# Altium project PCB_3U_Kasli.PrjPCB (part 2 of 7)

## Sheet ClockRecovery.SchDoc: =ProjectName
size 420 x 297 mm; Author: G.K. and P.K.; CompanyName: WUT; DrawnBy: P.K.; Organization: WUT ISE; Address1: Warsaw Univeristy of Technology; Address2: Nowowiejska 15/19; DocumentNumber: 6; Revision: 1.1; SheetNumber: 6; SheetTotal: 12; EDA_Number: ARTIQ; Projet: ARTIQ/SINARA; ModifiedBy: -; CreateDate: XX/XX/XXXX; CheckedDate: -; Title2: ClockRecovery.SchDoc; DivGrp: ISE; Designer: G.K.; ModifiedDate: -; ProjectName: ARTIQ/SINARA
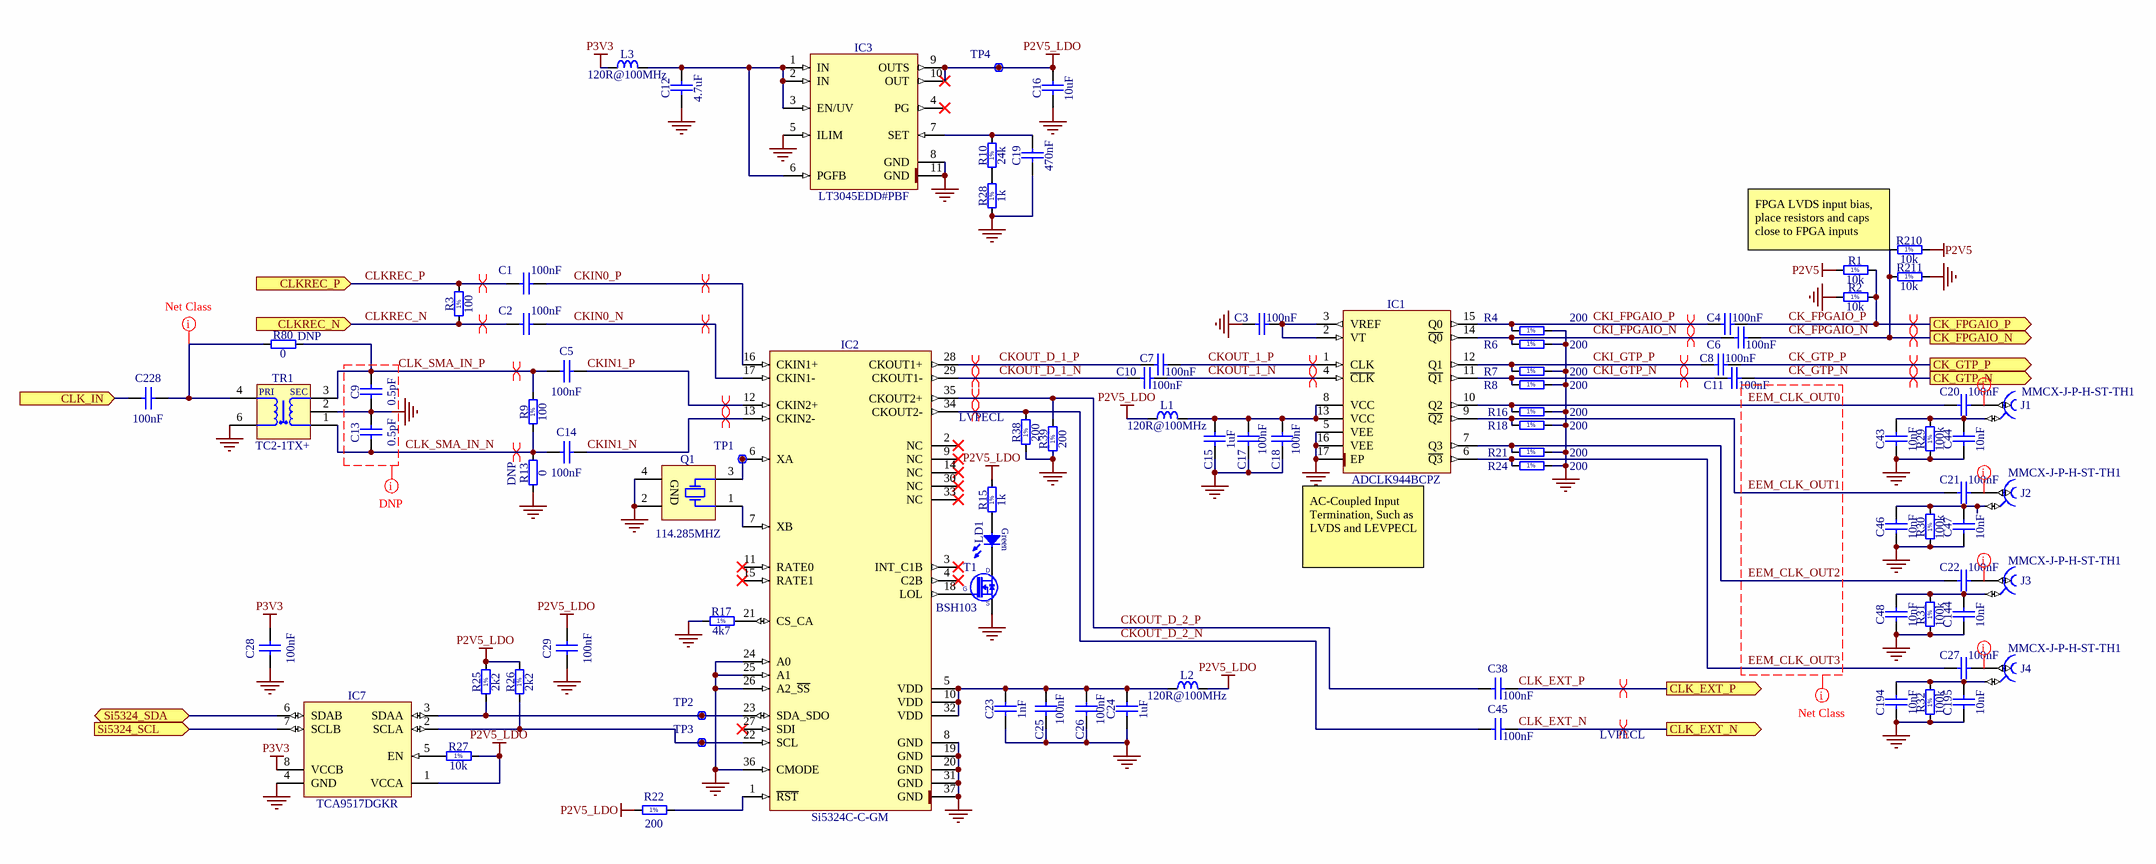
[diagram p2: ClockRecovery.SchDoc]

### Parts
C1  100nF  [CAPC0603X33N]
C2  100nF  [CAPC0603X33N]
C3  100nF  [CAPC0603X33N]
C4  100nF  [CAPC0603X33N]
C5  100nF  [CAPC0603X33N]
C6  100nF  [CAPC0603X33N]
C7  100nF  [CAPC0603X33N]
C8  100nF  [CAPC0603X33N]
C9  0.5pF  [CAPC1005X50N]
C10  100nF  [CAPC0603X33N]
C11  100nF  [CAPC0603X33N]
C12  4.7uF  [CAPC1005X55N]
C13  0.5pF  [CAPC1005X50N]
C14  100nF  [CAPC0603X33N]
C15  1uF  [CAPC1005X55N]
C16  10uF  [CAPC1005X70N]
C17  100nF  [CAPC0603X33N]
C18  100nF  [CAPC0603X33N]
C19  470nF  [CAPC1005X55N]
C20  100nF  [CAPC0603X33N]
C21  100nF  [CAPC0603X33N]
C22  100nF  [CAPC0603X33N]
C23  1nF  [CAPC1005X55N]
C24  1uF  [CAPC1005X55N]
C25  100nF  [CAPC0603X33N]
C26  100nF  [CAPC0603X33N]
C27  100nF  [CAPC0603X33N]
C28  100nF  [CAPC0603X33N]
C29  100nF  [CAPC0603X33N]
C38  100nF  [CAPC0603X33N]
C43  10nF  [CAPC1005X55N]
C44  10nF  [CAPC1005X55N]
C45  100nF  [CAPC0603X33N]
C46  10nF  [CAPC1005X55N]
C47  10nF  [CAPC1005X55N]
C48  10nF  [CAPC1005X55N]
C144  10nF  [CAPC1005X55N]
C194  10nF  [CAPC1005X55N]
C195  10nF  [CAPC1005X55N]
C228  100nF  [CAPC0603X33N]
IC1  ADCLK944BCPZ  [QFN50P300X300X80-17N-S160]
IC2  Si5324C-C-GM  [QFN50P600X600X90-37N-S425]
IC3  LT3045EDD#PBF  [SON50P300X300X80-11N-R175X248]
IC7  TCA9517DGKR  [SOP65P490X110-8N]
J1  MMCX-J-P-H-ST-TH1  [SAMTEC_MMCX-J-P-H-ST-TH1]
J2  MMCX-J-P-H-ST-TH1  [SAMTEC_MMCX-J-P-H-ST-TH1]
J3  MMCX-J-P-H-ST-TH1  [SAMTEC_MMCX-J-P-H-ST-TH1]
J4  MMCX-J-P-H-ST-TH1  [SAMTEC_MMCX-J-P-H-ST-TH1]
L1  120R@100MHz  [INDC1608X65N]
L2  120R@100MHz  [INDC1608X65N]
L3  120R@100MHz  [INDC1608X65N]
LD1  (no value)  [LED_KINGBRIGHT_KPH-1608CGCK]
Q1  114.285MHZ  [XTAL_CONNOR_CS]
R1  10k  [RESC1005X40N]
R2  10k  [RESC1005X40N]
R3  100  [RESC1005X40N]
R4  200  [RESC1005X40N]
R6  200  [RESC1005X40N]
R7  200  [RESC1005X40N]
R8  200  [RESC1005X40N]
R9  100  [RESC1005X40N]
R10  24k  [RESC1005X40N]
R13  0  [RESC1005X40N]
R15  1k  [RESC1005X40N]
R16  200  [RESC1005X40N]
R17  4k7  [RESC1005X40N]
R18  200  [RESC1005X40N]
R21  200  [RESC1005X40N]
R22  200  [RESC1005X40N]
R24  200  [RESC1005X40N]
R25  2k2  [RESC1005X40N]
R26  2k2  [RESC1005X40N]
R27  10k  [RESC1005X40N]
R28  1k  [RESC1005X40N]
R29  100k  [RESC1005X40N]
R30  100k  [RESC1005X40N]
R31  100k  [RESC1005X40N]
R32  100k  [RESC1005X40N]
R38  200  [RESC1005X40N]
R39  200  [RESC1005X40N]
R80  0  [RESC1005X40N]
R210  10k  [RESC1005X40N]
R211  10k  [RESC1005X40N]
T1  BSH103  [SOT95P230X110-3N]
TP1  Q1  [TPS127]  (value not drawn)
TP2  Si5324 I2C SDA  [TPS127]  (value not drawn)
TP3  Si5324 I2C SCL  [TPS127]  (value not drawn)
TP4  P2V5 LDO  [TPS127]  (value not drawn)
TR1  TC2-1TX+  [XFMR_MINI-CIRCUITS_AT1521]

### Ports
CK_FPGAIO_N (out), CK_FPGAIO_P (out), CK_GTP_N (out), CK_GTP_P (out), CLK_EXT_N (out), CLK_EXT_P (out), CLK_IN (in), CLKREC_N (in), CLKREC_P (in), Si5324_SCL (in), Si5324_SDA (bidir)

### Nets
GND: C3.1 C9.1 C12.1 C13.2 C15.1 C16.1 C17.1 C18.1 C19.1 C23.1 C24.1 C25.1 C26.1 C28.1 C29.1 C43.1 C44.1 C46.1 C47.1 C48.1 C144.1 C194.1 C195.1 IC1.5(VEE) IC1.16(VEE) IC1.17(EP) IC2.8(GND) IC2.19(GND) IC2.20(GND) IC2.24(A0) IC2.25(A1) IC2.26(A2_~{SS}) IC2.31(GND) IC2.36(CMODE) IC2.37(GND) IC3.5(ILIM) IC3.8(GND) IC3.11(GND) IC7.4(GND) Q1.2(GND) Q1.4(GND) R2.1 R4.2 R6.2 R7.2 R8.2 R13.1 R16.2 R17.1 R18.2 R21.2 R24.2 R28.1 R29.1 R30.1 R31.1 R32.1 R38.1 R39.1 R211.1 T1.2(S) TR1.2(NU) TR1.6(PDOT)
P2V5: R1.1 R210.1
P2V5_LDO: C16.2 C29.2 IC3.9(OUTS) IC3.10(OUT) IC7.1(VCCA) L1.2 L2.2 R15.2 R22.1 R25.2 R26.2 R27.1 TP4.1
P3V3: C28.2 IC7.8(VCCB) L3.1
CK_FPGAIO_N: C6.2 R210.2 R211.2 ; port CK_FPGAIO_N
CK_FPGAIO_P: C4.2 R1.2 R2.2 ; port CK_FPGAIO_P
CK_GTP_N: C11.2 ; port CK_GTP_N
CK_GTP_P: C8.2 ; port CK_GTP_P
CKI_FPGAIO_N: C6.1 IC1.14(~{Q0}) R6.1
CKI_FPGAIO_P: C4.1 IC1.15(Q0) R4.1
CKI_GTP_N: C11.1 IC1.11(~{Q1}) R8.1
CKI_GTP_P: C8.1 IC1.12(Q1) R7.1
CKIN0_N: C2.2 IC2.17(CKIN1-)
CKIN0_P: C1.2 IC2.16(CKIN1+)
CKIN1_N: C14.2 IC2.13(CKIN2-)
CKIN1_P: C5.2 IC2.12(CKIN2+)
CKOUT_1_N: C10.2 IC1.4(~{CLK})
CKOUT_1_P: C7.2 IC1.1(CLK)
CKOUT_D_1_N: C10.1 IC2.29(CKOUT1-)
CKOUT_D_1_P: C7.1 IC2.28(CKOUT1+)
CKOUT_D_2_N: C45.1 IC2.34(CKOUT2-) R38.2
CKOUT_D_2_P: C38.1 IC2.35(CKOUT2+) R39.2
CLK_EXT_N: C45.2 ; port CLK_EXT_N
CLK_EXT_P: C38.2 ; port CLK_EXT_P
CLK_SMA_IN_N: C13.1 C14.1 R9.1 R13.2 TR1.1(SDOT)
CLK_SMA_IN_P: C5.1 C9.2 R9.2 R80.2 TR1.3(S)
CLKREC_N: C2.1 R3.1 ; port CLKREC_N
CLKREC_P: C1.1 R3.2 ; port CLKREC_P
EEM_CLK_OUT0: C20.1 IC1.10(Q2) R16.1
EEM_CLK_OUT1: C21.1 IC1.9(~{Q2}) R18.1
EEM_CLK_OUT2: C22.1 IC1.7(Q3) R21.1
EEM_CLK_OUT3: C27.1 IC1.6(~{Q3}) R24.1
Si5324_SCL: IC7.7(SCLB) ; port Si5324_SCL
Si5324_SDA: IC7.6(SDAB) ; port Si5324_SDA
NetC3_2: C3.2 IC1.2(VT) IC1.3(VREF)
NetC12_2: C12.2 IC3.1(IN) IC3.2(IN) IC3.3(EN/UV) IC3.6(PGFB) L3.2
NetC15_2: C15.2 C17.2 C18.2 IC1.8(VCC) IC1.13(VCC) L1.1
NetC19_2: C19.2 IC3.7(SET) R10.2
NetC20_2: C20.2 J1.1
NetC21_2: C21.2 J2.1
NetC22_2: C22.2 J3.1
NetC23_2: C23.2 C24.2 C25.2 C26.2 IC2.5(VDD) IC2.10(VDD) IC2.32(VDD) L2.1
NetC27_2: C27.2 J4.1
NetC43_2: C43.2 C44.2 J1.2 R29.2
NetC46_2: C46.2 C47.2 J2.2 R30.2
NetC48_2: C48.2 C144.2 J3.2 R31.2
NetC194_2: C194.2 C195.2 J4.2 R32.2
NetC228_1: C228.1 ; port CLK_IN
NetC228_2: C228.2 R80.1 TR1.4(P)
NetIC2_1: IC2.1(~{RST}) R22.2
NetIC2_6: IC2.6(XA) Q1.3(X) TP1.1
NetIC2_7: IC2.7(XB) Q1.1(X)
NetIC2_18: IC2.18(LOL) T1.1(G)
NetIC2_21: IC2.21(CS_CA) R17.2
NetIC2_22: IC2.22(SCL) IC7.2(SCLA) R26.1 TP3.1
NetIC2_23: IC2.23(SDA_SDO) IC7.3(SDAA) R25.1 TP2.1
NetIC7_5: IC7.5(EN) R27.2
NetLD1_1: LD1.1(A) R15.1
NetLD1_2: LD1.2(C) T1.3(D)
NetR10_1: R10.1 R28.2

Not connected (* = marked no-connect by the designer): IC2 2(NC)* 3(INT_C1B)* 4(C2B)* 9(NC)* 11(RATE0)* 14(NC)* 15(RATE1)* 27(SDI)* 30(NC)* 33(NC)*; IC3 4(PG)*

### Layout directives
differential pair; net class Diff_100Ohm: CK_FPGAIO_N, CK_FPGAIO_P, CK_GTP_N, CK_GTP_P, CKI_FPGAIO_N, CKI_FPGAIO_P, CKI_GTP_N, CKI_GTP_P, CKIN0_N, CKIN0_P, CKIN1_N, CKIN1_P, CKOUT_1_N, CKOUT_1_P, CKOUT_D_1_N, CKOUT_D_1_P, CLK_SMA_IN_N, CLK_SMA_IN_P, CLKREC_N, CLKREC_P
differential pair; net class LVPECL: CKOUT_D_2_N, CKOUT_D_2_P, CLK_EXT_N, CLK_EXT_P
net class 50Ohm: EEM_CLK_OUT0, EEM_CLK_OUT1, EEM_CLK_OUT2, EEM_CLK_OUT3, NetC20_2, NetC21_2, NetC22_2, NetC27_2, NetC228_2
rule Undefined: CLK_SMA_IN_P, GND

### Notes on the sheet
- (near R210) FPGA LVDS input bias, place resistors and caps close to FPGA inputs
- (near R80) DNP
- (near R13) DNP
- (near IC1) AC-Coupled Input Termination, Such as LVDS and LEVPECL
- Project/Equipment
- Document
- Designer
- Drawn by
- Check.by
- File
- Last Mod.
- Print Date
- Sheet
- Size
- A3
- of
- Rev
- (in symbol KINGBRIGHT_KPTR-3216CGCK) Green
- (in symbol R0402_1k_1%_0.0625W_100PPM) 1%
- (in symbol R0402_1K_1%_0.0625W_100PPM) 1%
- (in symbol R0402_2K2_1%_0.0625W_100PPM) 1%
- (in symbol R0402_4K7_1%_0.0625W_100PPM) 1%
- (in symbol R0402_10K_1%_0.0625W_100PPM) 1%
- (in symbol R0402_24K_1%_0.0625W_100PPM) 1%
- (in symbol R0402_100K_1%_0.0625W_100PPM) 1%
- (in symbol R0402_100R_1%_0.0625W_100PPM) 1%
- (in symbol R0402_200R_1%_0.0625W_100PPM) 1%
- (in symbol XFMR_MINI-CIRCUITS_TC2-1TX+) PRI; SEC

### Library data of the parts
C1-C8 C10 C11 C14 C17 C18 C20-C22 C25-C29 C38 C45 C228 = CC0201_100NF_6.3V_10%_X5R: as C161 on sheet TOP; Part Number: CC0201_100NF_6.3V_10%_X5R; Component Kind: Standard; Component Type: Standard; Pin Count: 2; Value: 100nF; Status: Not Recommended; Manufacturer Part Number: CC0201_100NF_6.3V_10%_X5R; Case: 0201; Mounted: Yes; Socket: No; SMD: Yes; Sense: No; Manufacturer1 Example: AVX; Manufacturer1 ComponentHeight: 0.33mm; HelpURL: \\cern.ch\dfs\Applications\Altium\Datasheets\CC0201_X5R_AVX.pdf; Author: CERN DEM JLC; CreateDate: 2007-12-03; LatestRevisionDate: 2007-12-03
C9 C13 = CC0402_0.5PF_25V_0.05PF_AVX_04023J0R5ABSTR: Non-polarised capacitor; Part Description: Thin-Film Chip Capacitors for RF Signal and Power Applications, Accu-P Series; Manufacturer: AVX; Voltage: 25V; Tolerance: ±0.05pF; Part Number: CC0402_0.5PF_25V_0.05PF_AVX_04023J0R5ABSTR; Component Kind: Standard; Component Type: Standard; Pin Count: 2; Value: 0.5pF; Status: None; Manufacturer Part Number: 04023J0R5ABSTR; Case: 0402; Mounted: Yes; Socket: No; SMD: Yes; Sense: No; ComponentHeight: 0.5mm; HelpURL: \\cern.ch\dfs\Applications\Altium\Datasheets\CC0402_AVX_ACCU-P.pdf; Author: CERN DEM JLC; CreateDate: 2017-02-22; LatestRevisionDate: 2017-02-22
C12 = CC0402_4.7UF_6.3V_20%_X5R: Non-polarised capacitor; Part Description: SMD Multilayer Chip Ceramic Capacitor; Manufacturer: GENERIC; Manufacturer1 Part Number: C1005X5R0J475M050BC; Voltage: 6.3V; TC: X5R; Tolerance: ±20%; Part Number: CC0402_4.7UF_6.3V_20%_X5R; Component Kind: Standard; Component Type: Standard; Pin Count: 2; Value: 4.7uF; Status: Preferred; Manufacturer Part Number: CC0402_4.7UF_6.3V_20%_X5R; Case: 0402; Mounted: Yes; Socket: No; SMD: Yes; Sense: No; Manufacturer1 Example: TDK; Manufacturer1 ComponentHeight: 0.65mm; HelpURL: \\cern.ch\dfs\Applications\Altium\Datasheets\CC0402_X5R_TDK_C.pdf; Author: CERN DEM JLC; CreateDate: 03.03.2015; LatestRevisionDate: 03.03.2015
C15 C24 = CC0402_1UF_16V_10%_X5R: Non-polarised capacitor; Part Description: SMD Multilayer Chip Ceramic Capacitor; Manufacturer: GENERIC; Manufacturer1 Part Number: C1005X5R1C105KT; Voltage: 16V; TC: X5R; Tolerance: ±10%; Part Number: CC0402_1UF_16V_10%_X5R; Component Kind: Standard; Component Type: Standard; Pin Count: 2; Value: 1uF; Status: Preferred; Manufacturer Part Number: CC0402_1UF_16V_10%_X5R; Case: 0402; Mounted: Yes; Socket: No; SMD: Yes; Sense: No; Manufacturer1 Example: TDK; Manufacturer1 ComponentHeight: 0.55mm; HelpURL: \\cern.ch\dfs\Applications\Altium\Datasheets\CC0402_X5R_TDK_C.pdf; Author: CERN DEM JLC; CreateDate: 2012-10-25; LatestRevisionDate: 2012-10-25
C16 = CC0402_10UF_6.3V_20%_X5R: Non-polarised capacitor; Part Description: SMD Multilayer Chip Ceramic Capacitor; Manufacturer: GENERIC; Manufacturer1 Part Number: C1005X5R0J106M050BC; Voltage: 6.3V; TC: X5R; Tolerance: ±10%; Part Number: CC0402_10UF_6.3V_20%_X5R; Component Kind: Standard; Component Type: Standard; Pin Count: 2; Value: 10uF; Status: Preferred; Manufacturer Part Number: CC0402_10UF_6.3V_20%_X5R; Case: 0402; Mounted: Yes; Socket: No; SMD: Yes; Sense: No; Manufacturer1 Example: TDK; Manufacturer1 ComponentHeight: 0.70mm; HelpURL: \\cern.ch\dfs\Applications\Altium\Datasheets\CC0402_X5R_TDK_C.pdf; Author: CERN DEM JLC; CreateDate: 07.01.2015; LatestRevisionDate: 07.01.2015
C19 = CC0402_470NF_6.3V_10%_X5R: Non-polarised capacitor; Part Description: SMD Multilayer Chip Ceramic Capacitor; Manufacturer: GENERIC; Manufacturer1 Part Number: GRM155R60J474KE19D; Voltage: 6.3V; TC: X5R; Tolerance: ±10%; Part Number: CC0402_470NF_6.3V_10%_X5R; Component Kind: Standard; Component Type: Standard; Pin Count: 2; Value: 470nF; Status: Preferred; Manufacturer Part Number: CC0402_470NF_6.3V_10%_X5R; Case: 0402; Mounted: Yes; Socket: No; SMD: Yes; Sense: No; Manufacturer1 Example: MURATA; Manufacturer1 ComponentHeight: 0.55mm; HelpURL: \\cern.ch\dfs\Applications\Altium\Datasheets\CC0402_X5R_MURATA_GRM.pdf; Author: CERN DEM JLC; CreateDate: 22.04.2010; LatestRevisionDate: 22.04.2010
C23 = CC0402_1NF_50V_10%_X7R: Non-polarised capacitor; Part Description: SMD Multilayer Chip Ceramic Capacitor; Manufacturer: GENERIC; Manufacturer1 Part Number: 223858715623; Voltage: 50V; TC: X7R; Tolerance: ±10%; Part Number: CC0402_1NF_50V_10%_X7R; Component Kind: Standard; Component Type: Standard; Pin Count: 2; Value: 1nF; Status: Not Recommended; Manufacturer Part Number: CC0402_1NF_50V_10%_X7R; Case: 0402; Mounted: Yes; Socket: No; SMD: Yes; Sense: No; Manufacturer1 Example: PHYCOMP; Manufacturer1 ComponentHeight: 0.55mm; HelpURL: \\cern.ch\dfs\Applications\Altium\Datasheets\CC0402_X7R_PHYCOMP.pdf; Author: CERN DEM JLC; CreateDate: 03.12.2007; LatestRevisionDate: 03.12.2007
C43 C44 C46-C48 C144 C194 C195 = CC0402_10NF_16V_10%_X7R: as C225 on sheet TOP; Part Number: CC0402_10NF_16V_10%_X7R; Component Kind: Standard; Component Type: Standard; Pin Count: 2; Value: 10nF; Status: Not Recommended; Manufacturer Part Number: CC0402_10NF_16V_10%_X7R; Case: 0402; Mounted: Yes; Socket: No; SMD: Yes; Sense: No; Manufacturer1 Example: PHYCOMP; Manufacturer1 ComponentHeight: 0.55mm; HelpURL: \\cern.ch\dfs\Applications\Altium\Datasheets\CC0402_X7R_PHYCOMP.pdf; Author: CERN DEM JLC; CreateDate: 03.12.2007; LatestRevisionDate: 03.12.2007
IC1 = ADCLK944BCPZ: 2.5V/3.3V, Four LVPECL Outputs, SiGe Clock Fanout Buffer; Manufacturer: ANALOG DEVICES; PressFit: No; Bonding: No; Part Number: ADCLK944BCPZ; Component Kind: Standard; Component Type: Standard; Device: ADCLK944BCPZ; PackageDescription: QFN, 0.50mm Pitch, Square; 4 Pin X 4 Pin, 3mm X 3mm X 0.80mm H Body (w/Thermal tab 1.60 X 1.60mm),  IPC Medium Density; Part Description: 2.5V/3.3V, Four LVPECL Outputs, SiGe Clock Fanout Buffer; Manufacturer Part Number: ADCLK944BCPZ; Pin Count: 17; Case: QFN16; Mounted: Yes; Socket: No; SMD: Yes; Sense: No; ComponentHeight: 0.8mm; Author: CERN DEM JLC; HelpURL: \\cern.ch\dfs\Applications\Altium\Datasheets\ADCLK944BCPZ.pdf; CreateDate: 17.07.2014; LatestRevisionDate: 17.07.2014
IC2 = Si5324C-C-GM: Any Frequency Precision Clock Multiplier/Jitter Attenuator; Manufacturer: SILICON LABS; PressFit: No; Bonding: No; Part Number: Si5324C-C-GM; Component Kind: Standard; Component Type: Standard; Device: Si5324C-C-GM; PackageDescription: QFN, 0.50mm Pitch, Square; 36 Pin, 6.00mm L X 6.00mm W X 0.90mm H Body (w/thermal tab 4.25m x 4.25mm), IPC Medium Density; Part Description: Any Frequency Precision Clock Multiplier/Jitter Attenuator; Manufacturer Part Number: Si5324C-C-GM; Pin Count: 37; Case: QFN36; Mounted: Yes; Socket: No; SMD: Yes; Sense: No; ComponentHeight: 0.9mm; HelpURL: \\cern.ch\dfs\Applications\Altium\Datasheets\Si5324C-C-GM.pdf; Author: CERN DEM JLC; CreateDate: 19.08.2013; LatestRevisionDate: 19.08.2013
IC3 = LT3045EDD#PBF: 20V, 500mA, Ultralow Noise, Ultrahigh PSRR Linear Regulator; Manufacturer: LINEAR TECHNOLOGY; PressFit: No; Bonding: No; Part Number: LT3045EDD#PBF; Component Kind: Standard; Component Type: Standard; Device: LT3045EDD#PBF; PackageDescription: SON, 0.50mm Pitch, 10-pin, 3.00mm W  X 3.00mm L X 0.80mm Height, (w/thermal tab 1.75 X 2.48 mm), IPC Medium Density; Part Description: 20V, 500mA, Ultralow Noise, Ultrahigh PSRR Linear Regulator; Manufacturer Part Number: LT3045EDD#PBF; Pin Count: 11; Case: SON10; Mounted: Yes; Socket: No; SMD: Yes; Sense: No; ComponentHeight: 0.8mm; HelpURL: \\cern.ch\dfs\Applications\Altium\Datasheets\LT3045EDD#PBF.pdf; Author: CERN DEM JLC; CreateDate: 07.12.2016; LatestRevisionDate: 07.12.2016
IC7 = TCA9517DGKR: Level-Translating I2C Bus Repeater; Manufacturer: TEXAS INSTRUMENTS; PressFit: No; Bonding: No; Part Number: TCA9517DGKR; Component Kind: Standard; Component Type: Standard; Device: TCA9517DGKR; PackageDescription: SOP, 0.65mm, Pitch; 8 Pin, 3.0mm W X 3.0mm L X 1.10mm H Body, IPC Medium Density; Part Description: Level-Translating I2C Bus Repeater; Manufacturer Part Number: TCA9517DGKR; Pin Count: 8; Case: TSSOP8; Mounted: Yes; Socket: No; SMD: Yes; Sense: No; ComponentHeight: 1.1mm; Author: CERN DEM JLC; HelpURL: \\cern.ch\dfs\Applications\Altium\Datasheets\TCA9517DGKR.pdf; CreateDate: 07.07.2014; LatestRevisionDate: 07.07.2014
J1-J4 = SAMTEC_MMCX-J-P-H-ST-TH1: Part Description: Straight Through-hole 50 Ohm Micro Mini RF Jack, MMCX Series; Manufacturer: SAMTEC; PressFit: No; Part Number: SAMTEC_MMCX-J-P-H-ST-TH1; Component Kind: Standard; Component Type: Standard; Pin Count: 2; Mounted: Yes; Socket: No; Sense: No; SMD: No; Status: None; Manufacturer Part Number: MMCX-J-P-H-ST-TH1; ComponentHeight: 4.35mm; HelpURL: \\cern.ch\dfs\Applications\Altium\Datasheets\SAMTEC_MMCX-J-P-H-ST-TH1.pdf; Author: CERN DEM JLC; CreateDate: 05.12.2012; LatestRevisionDate: 05.12.2012
L1-L3 = IND0603_MURATA_BLM18SG121TN1D: Inductor; Part Description: SMD EMIFIL Suppression Chip Ferrite Bead; Manufacturer: MURATA; Power: 3A; Resistance: 0.025R; Tolerance: ±25%; Part Number: IND0603_MURATA_BLM18SG121TN1D; Component Kind: Standard; Component Type: Standard; Pin Count: 2; Value: 120R@100MHz; Status: None; Manufacturer Part Number: BLM18SG121TN1D; Case: 0603; Mounted: Yes; Socket: No; SMD: Yes; Sense: No; ComponentHeight: 0.65mm; HelpURL: \\cern.ch\dfs\Applications\Altium\Datasheets\IND0603_MURATA_BLM18S.pdf; Author: CERN DEM JLC; CreateDate: 23.07.2014; LatestRevisionDate: 23.07.2014
LD1 = KINGBRIGHT_KPTR-3216CGCK: as LD2 on sheet FPGA; ComponentHeight: 0.65mm; HelpURL: http://datasheet.octopart.com/KPH-1608CGCK-Kingbright-datasheet-62316526.pdf; Package Description: SMT Green LED, Case 0603, Body L 1.6 x W 0.8mm H 0.65mm
Q1 = XTAL_114.285MHZ_CONNOR_CS-023: Crystal 4 pins 1=XTAL Control 2=GND3=XTAL 4=GND; Part Description: ±20ppm 18pF -40°C to +85°C  4 Pins, 3.2x2.5X0.8mm, SMD Crystal Unit, CS-018 Series; Manufacturer: CONNOR-WINFIELD; Manufacturer Part Number: CS-023-114.285M; PressFit: No; Bonding: No; Part Number: XTAL_114.285MHZ_CONNOR_CS-023; Component Kind: Standard; Component Type: Standard; PackageDescription: 4 Pins, 2.5x3.2mm, SMD Sealing Crystal, CS Series; Value: 114.285MHZ; Pin Count: 4; Mounted: Yes; Socket: No; SMD: Yes; Sense: No; ComponentHeight: 0.8mm; HelpURL: \\cern.ch\dfs\Applications\Altium\Datasheets\XTAL_CONNOR_CS-023.pdf; Author: CERN DEM JLC; CreateDate: 2014-07-08; LatestRevisionDate: 2014-07-08
R1 R2 R27 R210 R211 = R0402_10K_1%_0.0625W_100PPM: Resistor - 1%; Part Description: General Purpose Thick Film Chip Resistor; Manufacturer: GENERIC; Manufacturer1 Part Number: 232270671003L; TC: ±100ppm/°C; PressFit: No; Part Number: R0402_10K_1%_0.0625W_100PPM; Component Kind: Standard; Component Type: Standard; Pin Count: 2; Value: 10k; Status: Not Recommended; Power: 0.0625W; Tolerance: ±1%; Manufacturer Part Number: R0402_10K_1%_0.0625W_100PPM; Case: 0402; Mounted: Yes; Sense: No; Socket: No; SMD: Yes; Manufacturer1 Example: YAGEO PHYCOMP; Manufacturer1 ComponentHeight: 0.4mm; HelpURL: \\cern.ch\dfs\Applications\Altium\Datasheets\R0402_Phycomp_RC0402.pdf; Author: CERN DEM JLC; CreateDate: 03.12.2007; LatestRevisionDate: 17.10.2012
R3 R9 = R0402_100R_1%_0.0625W_100PPM: Resistor - 1%; Part Description: General Purpose Thick Film Chip Resistor; Manufacturer: GENERIC; Manufacturer1 Part Number: 232270671001L; TC: ±100ppm/°C; PressFit: No; Part Number: R0402_100R_1%_0.0625W_100PPM; Component Kind: Standard; Component Type: Standard; Pin Count: 2; Value: 100; Status: Not Recommended; Power: 0.0625W; Tolerance: ±1%; Manufacturer Part Number: R0402_100R_1%_0.0625W_100PPM; Case: 0402; Mounted: Yes; Sense: No; Socket: No; SMD: Yes; Manufacturer1 Example: YAGEO PHYCOMP; Manufacturer1 ComponentHeight: 0.4mm; HelpURL: \\cern.ch\dfs\Applications\Altium\Datasheets\R0402_Phycomp_RC0402.pdf; Author: CERN DEM JLC; CreateDate: 03.12.2007; LatestRevisionDate: 17.10.2012
R4 R6-R8 R16 R18 R21 R22 R24 R38 R39 = R0402_200R_1%_0.0625W_100PPM: Resistor - 1%; Part Description: General Purpose Thick Film Chip Resistor; Manufacturer: GENERIC; Manufacturer1 Part Number: 232270672001L; TC: ±100ppm/°C; PressFit: No; Part Number: R0402_200R_1%_0.0625W_100PPM; Component Kind: Standard; Component Type: Standard; Pin Count: 2; Value: 200; Status: Not Recommended; Power: 0.0625W; Tolerance: ±1%; Manufacturer Part Number: R0402_200R_1%_0.0625W_100PPM; Case: 0402; Mounted: Yes; Sense: No; Socket: No; SMD: Yes; Manufacturer1 Example: YAGEO PHYCOMP; Manufacturer1 ComponentHeight: 0.4mm; HelpURL: \\cern.ch\dfs\Applications\Altium\Datasheets\R0402_Phycomp_RC0402.pdf; Author: CERN DEM JLC; CreateDate: 03.12.2007; LatestRevisionDate: 17.10.2012
R10 = R0402_24K_1%_0.0625W_100PPM: Resistor - 1%; Part Description: General Purpose Thick Film Chip Resistor; Manufacturer: GENERIC; Manufacturer1 Part Number: 232270672403L; TC: ±100ppm/°C; PressFit: No; Part Number: R0402_24K_1%_0.0625W_100PPM; Component Kind: Standard; Component Type: Standard; Pin Count: 2; Value: 24k; Status: Not Recommended; Power: 0.0625W; Tolerance: ±1%; Manufacturer Part Number: R0402_24K_1%_0.0625W_100PPM; Case: 0402; Mounted: Yes; Sense: No; Socket: No; SMD: Yes; Manufacturer1 Example: YAGEO PHYCOMP; Manufacturer1 ComponentHeight: 0.4mm; HelpURL: \\cern.ch\dfs\Applications\Altium\Datasheets\R0402_Phycomp_RC0402.pdf; Author: CERN DEM JLC; CreateDate: 03.12.2007; LatestRevisionDate: 17.10.2012
R13 R80 = R0402_0R_JUMPER: Resistor; Part Description: 1A (0.05R Max DC Resistance) Zero Ohm Jumper; Manufacturer: GENERIC; Manufacturer1 Part Number: 232270591001L; PressFit: No; Part Number: R0402_0R_JUMPER; Component Kind: Standard; Component Type: Standard; Pin Count: 2; Value: 0; Status: Not Recommended; Manufacturer Part Number: R0402_0R_JUMPER; Case: 0402; Mounted: Yes; Sense: No; Socket: No; SMD: Yes; Manufacturer1 Example: YAGEO PHYCOMP; Manufacturer1 ComponentHeight: 0.4mm; HelpURL: \\cern.ch\dfs\Applications\Altium\Datasheets\R0402_Phycomp_RC0402.pdf; Author: CERN DEM JLC; CreateDate: 03.12.2007; LatestRevisionDate: 17.10.2012
R15 = R0402_1k_1%_0.0625W_100PPM: as R11 on sheet FPGA; Part Number: R0402_1K_1%_0.0625W_100PPM; Component Kind: Standard; Component Type: Standard; Pin Count: 2; Value: 1k; Status: Not Recommended; Power: 0.0625W; Tolerance: ±1%; Manufacturer Part Number: R0402_1K_1%_0.0625W_100PPM; Case: 0402; Mounted: Yes; Sense: No; Socket: No; SMD: Yes; Manufacturer1 Example: YAGEO PHYCOMP; Manufacturer1 ComponentHeight: 0.4mm; HelpURL: \\cern.ch\dfs\Applications\Altium\Datasheets\R0402_Phycomp_RC0402.pdf; Author: CERN DEM JLC; CreateDate: 03.12.2007; LatestRevisionDate: 17.10.2012
R17 = R0402_4K7_1%_0.0625W_100PPM: Resistor - 1%; Part Description: General Purpose Thick Film Chip Resistor; Manufacturer: GENERIC; Manufacturer1 Part Number: 232270674702L; TC: ±100ppm/°C; PressFit: No; Part Number: R0402_4K7_1%_0.0625W_100PPM; Component Kind: Standard; Component Type: Standard; Pin Count: 2; Value: 4k7; Status: Not Recommended; Power: 0.0625W; Tolerance: ±1%; Manufacturer Part Number: R0402_4K7_1%_0.0625W_100PPM; Case: 0402; Mounted: Yes; Sense: No; Socket: No; SMD: Yes; Manufacturer1 Example: YAGEO PHYCOMP; Manufacturer1 ComponentHeight: 0.4mm; HelpURL: \\cern.ch\dfs\Applications\Altium\Datasheets\R0402_Phycomp_RC0402.pdf; Author: CERN DEM JLC; CreateDate: 03.12.2007; LatestRevisionDate: 17.10.2012
R25 R26 = R0402_2K2_1%_0.0625W_100PPM: as R94 on sheet TOP; Part Number: R0402_2K2_1%_0.0625W_100PPM; Component Kind: Standard; Component Type: Standard; Pin Count: 2; Value: 2k2; Status: Not Recommended; Power: 0.0625W; Tolerance: ±1%; Manufacturer Part Number: R0402_2K2_1%_0.0625W_100PPM; Case: 0402; Mounted: Yes; Sense: No; Socket: No; SMD: Yes; Manufacturer1 Example: YAGEO PHYCOMP; Manufacturer1 ComponentHeight: 0.4mm; HelpURL: \\cern.ch\dfs\Applications\Altium\Datasheets\R0402_Phycomp_RC0402.pdf; Author: CERN DEM JLC; CreateDate: 03.12.2007; LatestRevisionDate: 17.10.2012
R28 = R0402_1K_1%_0.0625W_100PPM: as R42 on sheet FPGA; Part Number: R0402_1K_1%_0.0625W_100PPM; Component Kind: Standard; Component Type: Standard; Pin Count: 2; Value: 1k; Status: Not Recommended; Power: 0.0625W; Tolerance: ±1%; Manufacturer Part Number: R0402_1K_1%_0.0625W_100PPM; Case: 0402; Mounted: Yes; Sense: No; Socket: No; SMD: Yes; Manufacturer1 Example: YAGEO PHYCOMP; Manufacturer1 ComponentHeight: 0.4mm; HelpURL: \\cern.ch\dfs\Applications\Altium\Datasheets\R0402_Phycomp_RC0402.pdf; Author: CERN DEM JLC; CreateDate: 03.12.2007; LatestRevisionDate: 17.10.2012
R29-R32 = R0402_100K_1%_0.0625W_100PPM: as R214 on sheet TOP; Part Number: R0402_100K_1%_0.0625W_100PPM; Component Kind: Standard; Component Type: Standard; Pin Count: 2; Value: 100k; Status: Not Recommended; Manufacturer Part Number: R0402_100K_1%_0.0625W_100PPM; Case: 0402; Mounted: Yes; Sense: No; Socket: No; SMD: Yes; Manufacturer1 Example: YAGEO PHYCOMP; Manufacturer1 ComponentHeight: 0.4mm; HelpURL: \\cern.ch\dfs\Applications\Altium\Datasheets\R0402_Phycomp_RC0402.pdf; Author: CERN DEM JLC; CreateDate: 03.12.2007; LatestRevisionDate: 17.10.2012; Power: 0.0625W; Tolerance: ±1%
T1 = BSH103: as T2 on sheet FPGA; Part Number: BSH103; Component Kind: Standard; Component Type: Standard; Device: BSH103; PackageDescription: SOT23, 3 pin, Pitch 0.95mm - 1.3mm W X 2.9mm L X 1.1mm H, IPC Medium Density; Manufacturer Part Number: BSH103; Pin Count: 3; Case: SOT23-3; Mounted: Yes; Socket: No; SMD: Yes; Sense: No; ComponentHeight: 1.1mm; HelpURL: \\cern.ch\dfs\Applications\Altium\Datasheets\BSH103.pdf; Author: CERN DEM JLC; CreateDate: 16.03.2010; LatestRevisionDate: 20.06.2017
TP1-TP4 = SMD_PAD_1.27X1.27MM: Test Point; Part Description: 1.27mm x 1.27mm PCB Copper Area (SMD Test Point); Mounted: No; Part Number: SMD_PAD_1.27X1.27MM; Component Kind: Standard (No BOM); Component Type: Standard (No BOM); Pin Count: 1; Family: Test Point; Socket: No; SMD: Yes; Sense: No; Status: None; ComponentHeight: 0mm; HelpURL: Undefined; Author: CERN DEM JLC; CreateDate: 12.01.2008; LatestRevisionDate: 12.01.2008; PackageDescription: 1.27mm x 1.27mm PCB Copper Area (SMD Test Point)
TR1 = XFMR_MINI-CIRCUITS_TC2-1TX+: 50 Ohm 3 to 300MHz RF Transformers; Manufacturer: MINI-CIRCUITS; Manufacturer Part Number: TC2-1TX+; HelpURL: https://ww2.minicircuits.com/pdfs/TC2-1TX+.pdf